# EAGLE design AST1042 (EAGLE 6.3)
DATABASE: ./../../../../../Components/TinyCircuits_Part_Database.txt
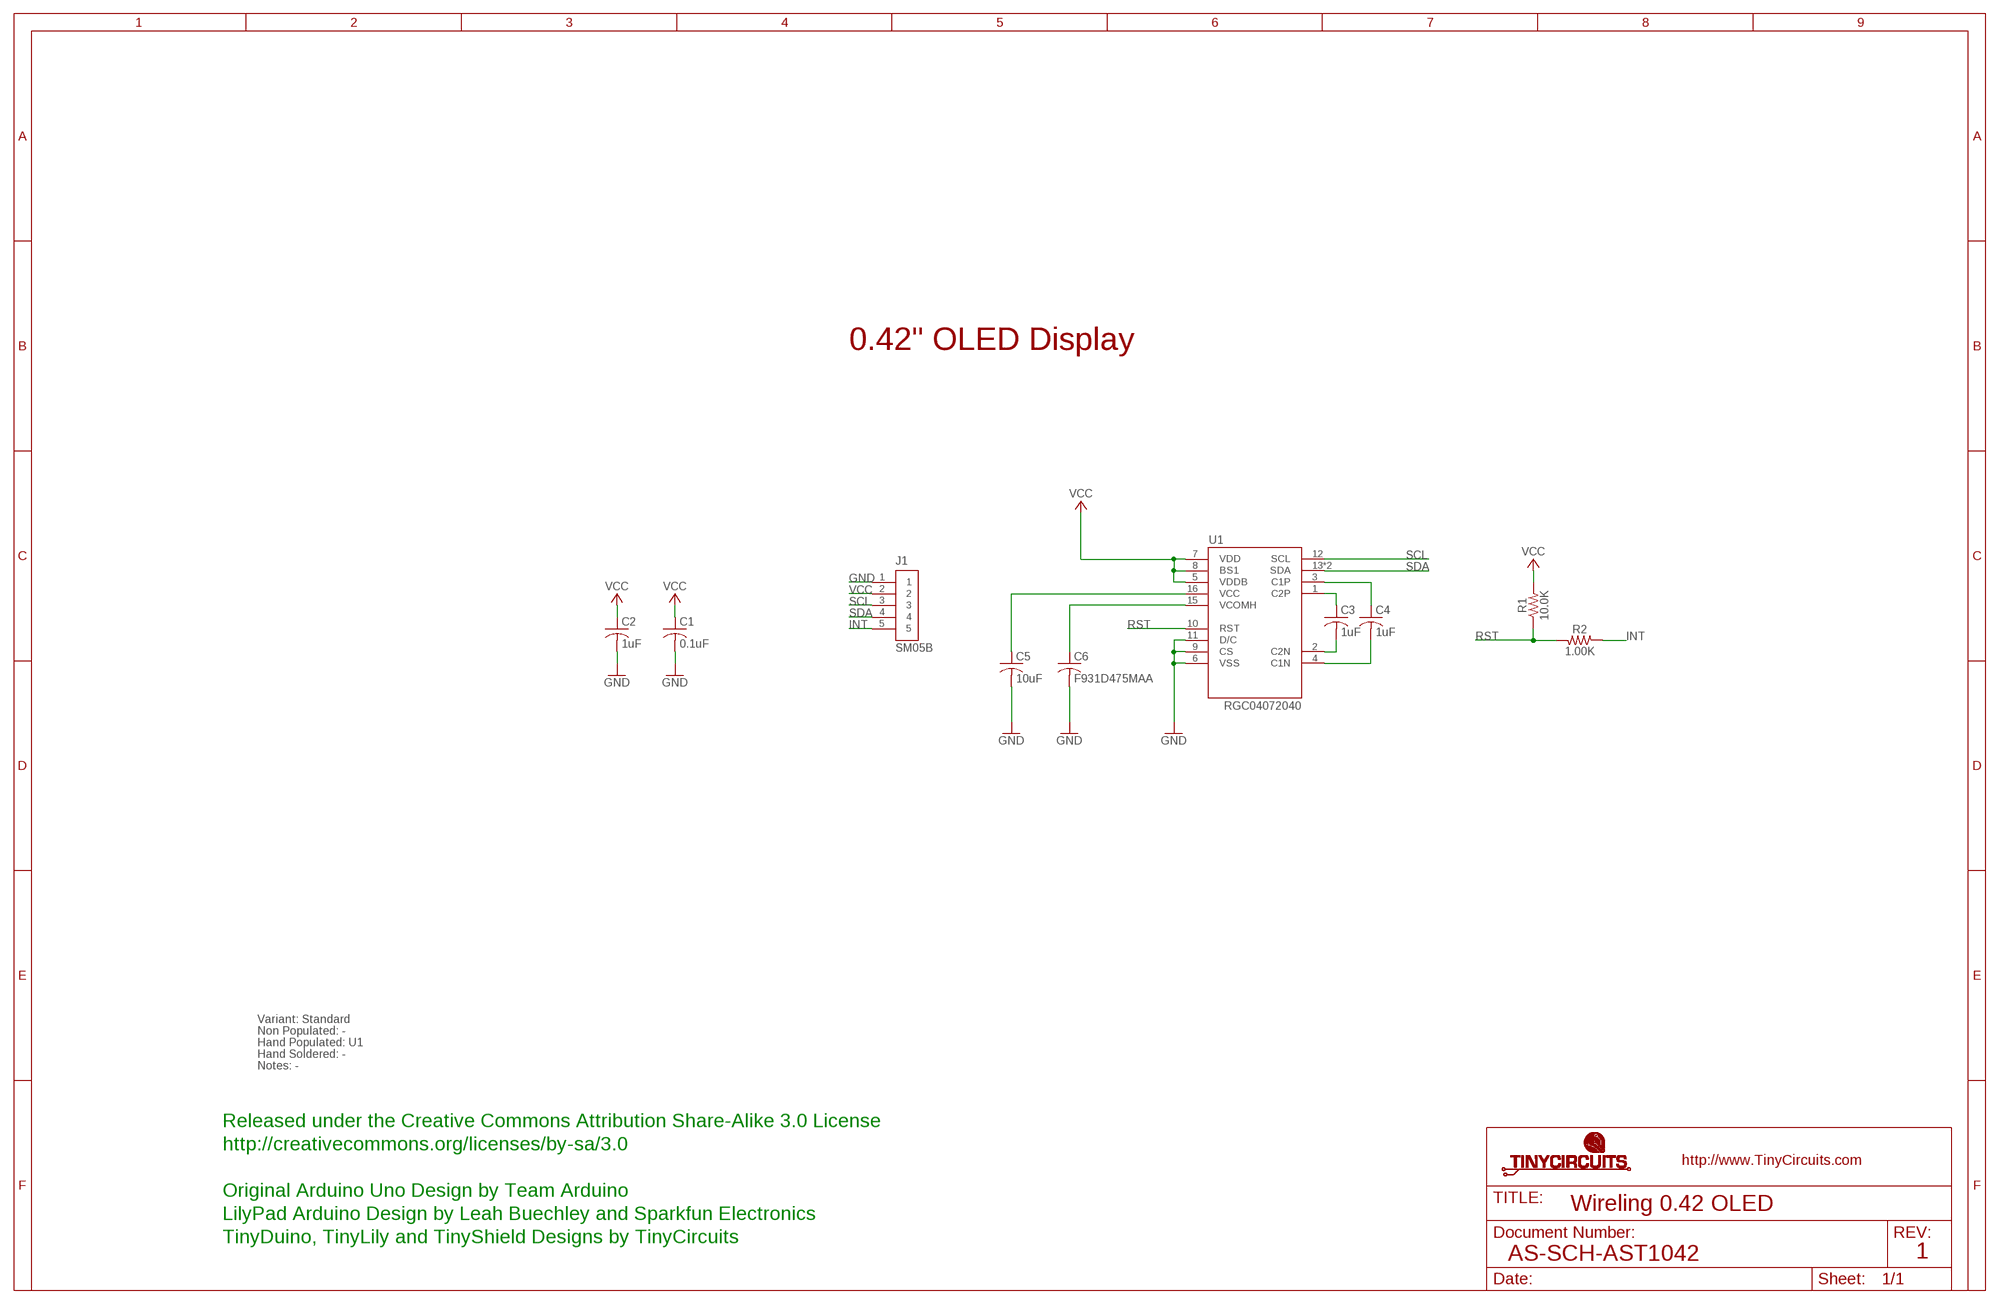
[diagram p0: schematic, sheet 1]

## Parts
C1  0.1uF  AS-ITM-00008  [C0402]
C2  1uF  AS-ITM-00410  [C0603]
C3  1uF  AS-ITM-00347  [C0603]
C4  1uF  AS-ITM-00347  [C0603]
C5  10uF  AS-ITM-00045  [C0805]
C6  F931D475MAA  AS-ITM-00232  [1206_CAP_TANT]
J1  SM05B  AS-ITM-00340EDGE  [JST_SH_5X1_EDGE]
R1  10.0K  AS-ITM-00032  [0402]
R2  1.00K  AS-ITM-00003  [0402]
U1  RGC04072040  AS-ITM-00485  [OLED_042]

## Nets
GND: C1.2 C2.2 C5.2 C6.2 J1.1 U1.6(VSS) U1.9(CS) U1.11(D/C)
INT: J1.5 R2.1
N$3: C6.1 U1.15(VCOMH)
N$6: C3.1 U1.1(C2P)
N$8: C5.1 U1.16(VCC)
N$10: C4.1 U1.3(C1P)
N$11: C3.2 U1.2(C2N)
N$12: C4.2 U1.4(C1N)
RST: R1.1 R2.2 U1.10(RST)
SCL: J1.3 U1.12(SCL)
SDA: J1.4 U1.13(SDA) U1.14(SDA)
VCC: C1.1 C2.1 J1.2 R1.2 U1.5(VDDB) U1.7(VDD) U1.8(BS1)

## Notes on the sheet
- 0.42" OLED Display
- Variant: Standard
- Non Populated: -
- Hand Populated: U1
- Hand Soldered: -
- Notes: -
- Released under the Creative Commons Attribution Share-Alike 3.0 License
- http://creativecommons.org/licenses/by-sa/3.0
- Original Arduino Uno Design by Team Arduino
- Wireling 0.42 OLED
- LilyPad Arduino Design by Leah Buechley and Sparkfun Electronics
- TinyDuino, TinyLily and TinyShield Designs by TinyCircuits
- AS-SCH-AST1042 | 1

## Library data of the parts
C1 = tinycircuits:AS-ITM-00008: CAP CER 0.1UF 16V 10% X5R 0402; PARTNO: AS-ITM-00008
C2 = tinycircuits:AS-ITM-00410: CAP CER 1UF 10V X5R 0603; PARTNO: AS-ITM-00410
C3 C4 = tinycircuits:AS-ITM-00347: CAP CER 1UF 16V X7R 0603; PARTNO: AS-ITM-00347
C5 = tinycircuits:AS-ITM-00045: CAP CER 16UF 16V 20% X5R 0805; PARTNO: AS-ITM-00045
C6 = tinycircuits:AS-ITM-00232: CAP TANT 4.7UF 20V 20% 1206; PARTNO: AS-ITM-00232; PNPROTATION: 180
J1 = tinycircuits:AS-ITM-00340: CONN HEADER SH 5POS SIDE 1MM TIN; PARTNO: AS-ITM-00340; PNPROTATION: 180
R1 = tinycircuits:AS-ITM-00032: RES 10.0K OHM 1/16W 1% 0402 SMD; PARTNO: AS-ITM-00032
R2 = tinycircuits:AS-ITM-00003: RES 1.00K OHM 1/16W 1% 0402; PARTNO: AS-ITM-00003
U1 = tinycircuits:AS-ITM-00485: OLED MONOCHROME 0.42" 72x40; PARTNO: AS-ITM-00485

## Net classes
2 gnd: width 0.305 mm, drill 0.559 mm, clearance 0.254 mm

## Board
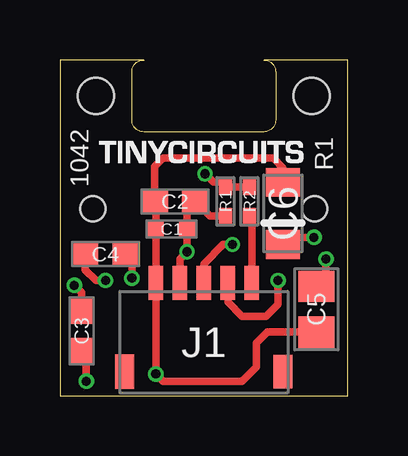
[diagram p1: board, top side]
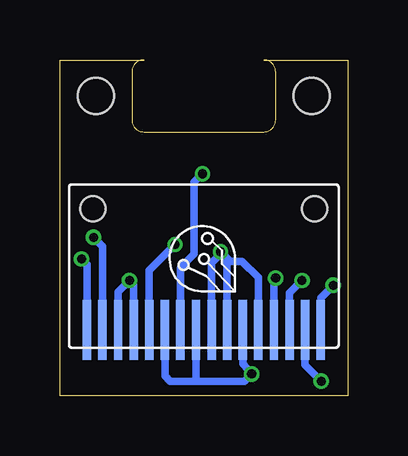
[diagram p2: board, bottom side, seen from below]

Size 12 x 14 mm. Coordinates in mm from the lower left corner, seen from the top.
Outline: 0,0 12,0 12,14 8.5,14 arc-90 9,13.5 9,11.5 arc-90 8.5,11 3.5,11 arc-90 3,11.5 3,13.5 arc-90 3.5,14 0,14 0,0
Copper layers (1*16): Top 0.035mm / dielectric 1.5mm / Bottom 0.035mm
Design rules "default *": minimum track width 8mil, minimum drill 15mil, track to track 7mil, track to pad 7mil, pad to pad 7mil, via to via 7mil, smd to smd 7mil, copper to edge 8mil, drill to drill 8mil, minimum pad ring 8mil, minimum via ring 5mil, stop-mask expansion 4mil, vias tented up to drill 25mil, thermal gap 10mil
Holes 1.5 mm at 1.5,12.5 10.5,12.5

### Footprints (pad centres in the part's own frame; a part is rotated, then mirrored left to right if it is on the bottom)
C0402 = smd 0.65 x 0.6: 1 -0.65,0; 2 0.65,0
C0603 = smd 1.1 x 1: 1 -0.85,0; 2 0.85,0
C0805 = smd 1.3 x 1.5: 1 -0.95,0; 2 0.95,0
1206_CAP_TANT = smd 1.2 x 1.4: 1 -1.3,0; 2 1.3,0
JST_SH_5X1_EDGE = smd 0.6 x 1.4: 1 -2,2.475; 2 -1,2.475; 3 0,2.475; 4 1,2.475; 5 2,2.475 | smd 0.8 x 1.4: PAD1 -3.3,-1.225; PAD2 3.3,-1.225
0402 = smd 0.65 x 0.55: 1 -0.6,0; 2 0.6,0
OLED_042 = smd 0.35 x 2.5: 1 4.875,-2.65; 2 4.225,-2.65; 3 3.575,-2.65; 4 2.925,-2.65; 5 2.275,-2.65; 6 1.625,-2.65; 7 0.975,-2.65; 8 0.325,-2.65; 9 -0.325,-2.65; 10 -0.975,-2.65; 11 -1.625,-2.65; 12 -2.275,-2.65; 13 -2.925,-2.65; 14 -3.575,-2.65; 15 -4.225,-2.65; 16 -4.875,-2.65 | hole 1.05: 4.625,2.4; -4.625,2.4

### Placement (x,y rotation side)
C1  4.65,6.95 180 top
C2  4.8,8.1 180 top
C3  0.9,2.7 270 top
C4  1.9,5.9 0 top
C5  10.7,3.6 270 top
C6  9.3,7.6 90 top
J1  6,2.23 0 top
R1  6.9,8.1 270 top
R2  7.9,8.1 90 top
U1  6,5.4 0 bottom
U$1  [DOCFIELD-TINYCIRCUITS-PCB]  29.5,-15 0 top  (outside the outline)

### Tracks (layer width: path | path; a pad name or v marks a point on that pad's centre or on a via)
GND  (via drill 0.38)
  Top 0.305: C6.2 9.3,9.5 8.9,9.9 4.3,9.9 3.95,9.55 C2.2 4,8.05 C1.2 J1.1 v4,0.9 4.3,0.6 7.6,0.6 8.2,1.2 8.2,2.2 8.65,2.65 C5.2
  Bottom 0.305: U1.6 4.38,1.32 v4,0.9 4.3,0.6 6.4,0.6 | U1.11 7.62,0.82 7.4,0.6 6.4,0.6 | U1.9 6.32,0.68 6.4,0.6
INT
  Top 0.305: J1.5 8,7.4 R2.1
N$3  (via drill 0.38)
  Top 0.305: v10.6,6.6 9.6,6.6 C6.1
  Bottom 0.305: U1.15 10.23,6.23 v10.6,6.6
N$6  (via drill 0.38)
  Top 0.305: v0.6,4.6 0.9,4.3 C3.1
  Bottom 0.305: U1.1 1.12,4.07 v0.6,4.6
N$8  (via drill 0.38)
  Top 0.305: v11.1,5.7 11.1,4.95 C5.1
  Bottom 0.305: U1.16 10.88,5.48 v11.1,5.7
N$10  (via drill 0.38)
  Top 0.305: v1.9,4.8 1.5,4.8 1.05,5.25 C4.1
  Bottom 0.305: U1.3 2.43,4.27 v1.9,4.8
N$11  (via drill 0.38)
  Top 0.305: v1.1,0.6 1.1,1.45 C3.2
  Bottom 0.305: U1.2 1.77,1.27 v1.1,0.6
N$12  (via drill 0.38)
  Top 0.305: v3,4.9 3,5.65 C4.2
  Bottom 0.305: U1.4 3.07,4.82 v3,4.9
RST  (via drill 0.38)
  Top 0.305: R2.2 R1.1 6.7,8.9 6.4,8.9 v6.05,9.25
  Bottom 0.305: U1.10 6.98,5.32 6.4,5.9 6.4,8.9 v6.05,9.25
SCL  (via drill 0.38)
  Top 0.305: v7.2,6.3 6.8,6.3 6,5.5 J1.3
  Bottom 0.305: U1.12 8.27,5.23 v7.2,6.3
SDA  (via drill 0.38)
  Top 0.305: J1.4 7,3.9 7.6,3.3 8.6,3.3 9.1,3.8 v9.1,4.8
  Bottom 0.305: U1.13 8.93,4.62 v9.1,4.8 9.57,4.32 U1.14
VCC  (via drill 0.38)
  Top 0.305: J1.2 5,5.7 v5.3,6 C1.1 5.3,7.75 C2.1 6.25,7.5 R1.2
  Bottom 0.305: U1.5 3.73,4.93 4.4,5.6 4.9,5.6 4.95,5.65 | 4.95,5.65 v5.3,6 | U1.7 5.02,5.57 | 5.02,5.57 4.95,5.65 | U1.8 5.68,5.52 5.3,5.9 5.1,5.7 5.02,5.57

### Text on the board
tPlace: 1042 | R1
Document: FABRICATION DRAWING | NOTES: | 1. PRINTED CIRCUIT BOARD MADE FROM NEMA GRADE FR-4 EPOXY LAMINATE | WITH 1 OUNCE COPPER PLATING AND .024 THICKNESS. | 2. ALL DIMENSIONS ARE GIVEN IN MILLIMETERS. | 3. CIRCUIT PATHS ARE FOR REFERENCE ONLY. | 4. HOLE SIZES SHOWN ARE FINISHED DIAMETERS AFTER PLATING. | 5. BOARD PLATED USING REFLOW OR SIMILAR METHOD. | 6. BOARD TO HAVE BLUE SOLDER MASK ON PLATED SURFACES USING WET FILM | 7. SILKSCREEN BOARD USING WHITE INK. | SR100 OR SR1010 EPOXY. EQUIVALENT WET OR DRY FILM MAY BE USED. | 8. THE FOLLOWING INFORMATION APPLIES TO THIS BOARD: | * 2 COPPER LAYERS | * .024 BOARD THICKNESS | * REQUIRES TOP SIDE SILKSCREEN | Released under the Creative Commons Attribution Share-Alike 3.0 License | http://creativecommons.org/licenses/by-sa/3.0 | Original Arduino Uno Design by Team Arduino | LilyPad Arduino Design by Leah Buechley and Sparkfun Electronics | TinyDuino, TinyLily and TinyShield Designs by TinyCircuits | Wireling 0.42 OLED | AS-PCB-AST1042 | 1